# EAGLE schematic avr (EAGLE 6.5.0)
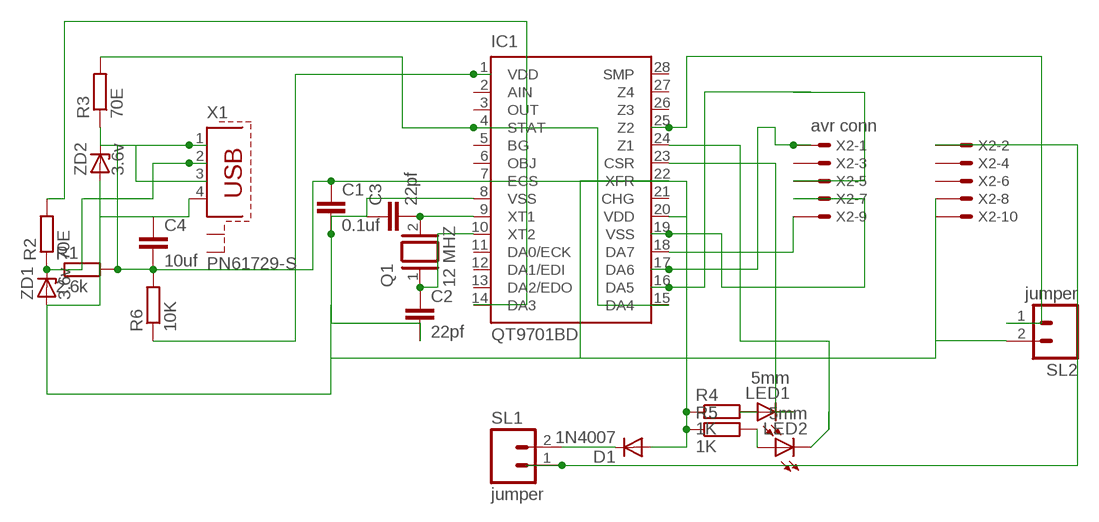
[diagram p0: schematic, sheet 1]

## Parts
C1  0.1uf  C2,5-3  [C2.5-3]
C2  22pf  C2,5-3  [C2.5-3]
C3  22pf  C2,5-3  [C2.5-3]
C4  10uf  C2,5-3  [C2.5-3]
D1  1N4007  1N4004  [DO41-10]
IC1  QT9701BD  [DIL28-3]
LED1  5mm  LED5MM  [LED5MM]
LED2  5mm  LED5MM  [LED5MM]
Q1  12 MHZ  XTAL/S  [QS]
R1  2.6k  R-EU_0204/7  [0204/7]
R2  70E  R-EU_0204/7  [0204/7]
R3  70E  R-EU_0204/7  [0204/7]
R4  1K  R-EU_0204/7  [0204/7]
R5  1K  R-EU_0204/7  [0204/7]
R6  10K  R-EU_0204/7  [0204/7]
SL1  jumper  M02  [02P]
SL2  jumper  M02  [02P]
X1  PN61729-S  [PN61729-S]
X2  avr conn  057-010-1  [057-010-1]
ZD1  3.6v  BZD23  [SOD81]
ZD2  3.6v  BZD23  [SOD81]

## Nets
N$1: C3.2 IC1.9(XT1) Q1.2
N$2: C2.1 IC1.10(XT2) Q1.1
N$3: IC1.1(VDD) R6.1
N$4: R1.1 R2.1 X1.2 ZD1.C
N$5: C1.2 C2.2 C3.1 C4.1 IC1.8(VSS) IC1.22(XFR) SL2.2 X1.4 X2.8 X2.10 ZD1.A ZD2.A
N$6: IC1.14(DA3) R2.2
N$7: R3.1 X1.3 ZD2.C
N$8: IC1.4(STAT) IC1.15(DA4) R3.2
N$9: C1.1 C4.2 D1.A IC1.7(ECS) IC1.20(VDD) R1.2 R4.1 R5.1 R6.2 X1.1
N$10: IC1.24(Z1) LED2.K(C)
N$11: D1.C SL1.2
N$13: IC1.23(CSR) LED1.K(C)
N$14: LED2.A R5.2
N$15: SL1.1 X2.2
N$16: IC1.17(DA6) X2.1
N$17: IC1.16(DA5) X2.5
N$18: IC1.19(VSS) X2.7
N$19: IC1.18(DA7) X2.9
N$20: IC1.25(Z2) SL2.1
N$21: LED1.A R4.2
Unconnected: IC1.2(AIN) IC1.3(OUT) IC1.5(BG) IC1.6(OBJ) IC1.11(DA0/ECK) IC1.12(DA1/EDI) IC1.13(DA2/EDO) IC1.21(CHG) IC1.26(Z3) IC1.27(Z4) IC1.28(SMP) X1.S1 X1.S2 X2.3 X2.4 X2.6

## Library data of the parts
C1-C4 = capacitor-wima:C: CAPACITOR naming: grid - package width
D1 = diode:1N4004: DIODE general purpose rectifier, 1 A
IC1 = quantum-research-group:QT9701B: Charge-Transfer Capacitance Sensor IC Source: http://data.qprox.com/downloads/datasheets/qt9701b.pdf; OC_FARNELL: unknown; OC_NEWARK: unknown
LED1 LED2 = led:LED: LED OSRAM: - CHIPLED LG R971, LG N971, LY N971, LG Q971, LY Q971, LO R971, LY R971 LH N974, LH R974 LS Q976, LO Q976, LY Q976 LO Q996 - Hyper CHIPLED LW Q18S LB Q993, LB Q99A, LB R99A - SideLED LS A670, LO A670, LY A670, LG A670, LP A670 LB A673, LV A673, LT A673, LW A673 LH A674 LY A675 LS A676, LA A676, LO A676, LY A676, LW A676 LS A679, LY A679, LG A679 - Hyper Micro SIDELED® LS Y876, LA Y876, LO Y876, LY Y876 LT Y87S - SmartLED LW L88C, LW L88S LB L89C, LB L89S, LG L890 LS L89K, LO L89K, LY L89K LS L896, LA L896, LO L896, LY L896 - TOPLED LS T670, LO T670, LY T670, LG T670, LP T670 LSG T670, LSP T670, LSY T670, LOP T670, LYG T670 LG T671, LOG T671, LSG T671 LB T673, LV T673, LT T673, LW T673 LH T674 LS T676, LA T676, LO T676, LY T676, LB T676, LH T676, LSB T676, LW T676 LB T67C, LV T67C, LT T67C, LS T67K, LO T67K, LY T67K, LW E67C LS E67B, LA E67B, LO E67B, LY E67B, LB E67C, LV E67C, LT E67C LW T67C LS T679, LY T679, LG T679 LS T770, LO T770, LY T770, LG T770, LP T770 LB T773, LV T773, LT T773, LW T773 LH T774 LS E675, LA E675, LY E675, LS T675 LS T776, LA T776, LO T776, LY T776, LB T776 LHGB T686 LT T68C, LB T68C - Hyper Mini TOPLED® LB M676 - Mini TOPLED Santana® LG M470 LS M47K, LO M47K, LY M47K Source: http://www.osram.convergy.de LUXEON: - LUMILED® LXK2-PW12-R00, LXK2-PW12-S00, LXK2-PW14-U00, LXK2-PW14-V00 LXK2-PM12-R00, LXK2-PM12-S00, LXK2-PM14-U00 LXK2-PE12-Q00, LXK2-PE12-R00, LXK2-PE12-S00, LXK2-PE14-T00, LXK2-PE14-U00 LXK2-PB12-K00, LXK2-PB12-L00, LXK2-PB12-M00, LXK2-PB14-N00, LXK2-PB14-P00, LXK2-PB14-Q00 LXK2-PR12-L00, LXK2-PR12-M00, LXK2-PR14-Q00, LXK2-PR14-R00 LXK2-PD12-Q00, LXK2-PD12-R00, LXK2-PD12-S00 LXK2-PH12-R00, LXK2-PH12-S00 LXK2-PL12-P00, LXK2-PL12-Q00, LXK2-PL12-R00 Source: www.luxeon.com KINGBRIGHT: KA-3528ASYC Source: www.kingbright.com
Q1 = special:XTAL/S: CRYSTAL
R1-R6 = resistor:R-EU_: RESISTOR, European symbol
SL1 SL2 = con-amp-quick:M02: AMP QUICK CONNECTOR; OC_FARNELL: unknown; OC_NEWARK: unknown
X1 = con-berg:PN61729-S: BERG USB connector; OC_FARNELL: unknown; OC_NEWARK: unknown
X2 = con-panduit:057-010-: CONNECTOR 10-pin series 057 contact pc board low profile headers; OC_FARNELL: unknown; OC_NEWARK: unknown
ZD1 ZD2 = diode:BZD23: Z DIODE